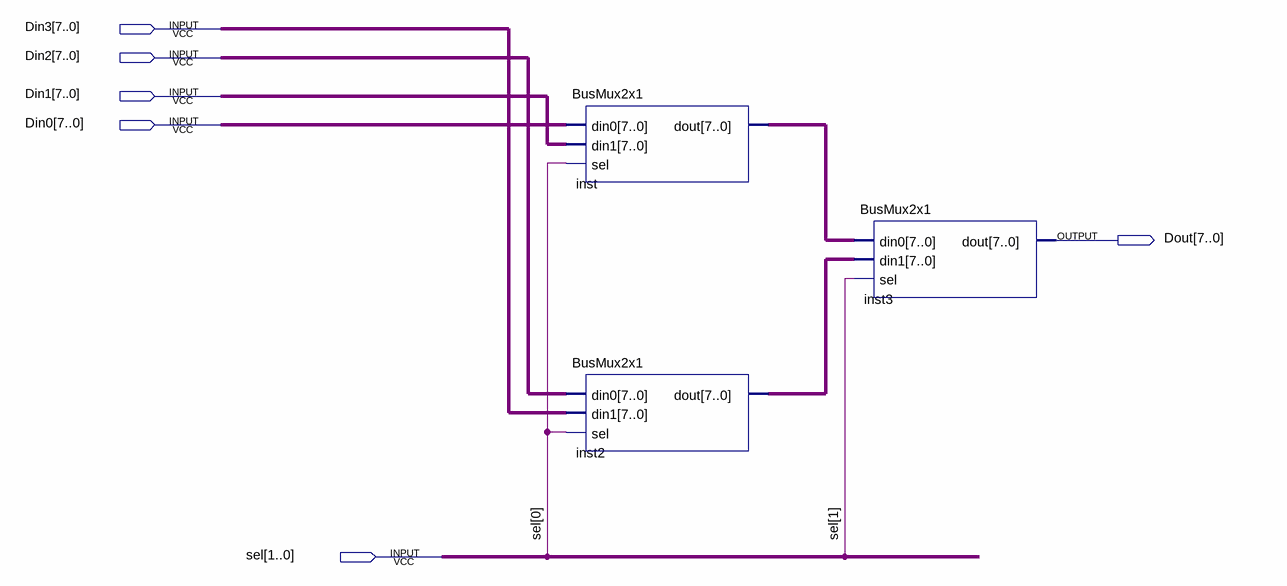
[diagram p0: schematic sheet]
// Quartus schematic Mux8bit4x1.bdf as structural Verilog: 3 symbols, 6 pins
module Mux8bit4x1 (
  input  [7:0] Din3,
  input  [7:0] Din2,
  input  [7:0] Din1,
  input  [7:0] Din0,
  input  [1:0] sel,
  output [7:0] Dout
);

  wire [7:0] inst2_dout, inst_dout;

  BusMux2x1 inst (.din0(Din0), .din1(Din1), .sel(sel[0]), .dout(inst_dout));
  BusMux2x1 inst2 (.din0(Din2), .din1(Din3), .sel(sel[0]), .dout(inst2_dout));
  BusMux2x1 inst3 (.din0(inst_dout), .din1(inst2_dout), .sel(sel[1]), .dout(Dout));
endmodule
